# Altium schematic sheet mechanical.SchDoc
size A
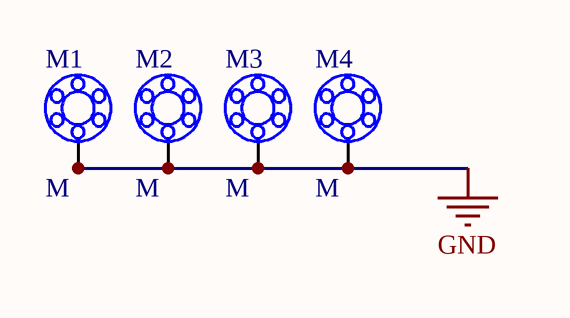
[diagram p0: mechanical.SchDoc]

## Parts
M1  M  [MOUNTING]  (no BOM)
M2  M  [MOUNTING]  (no BOM)
M3  M  [MOUNTING]  (no BOM)
M4  M  [MOUNTING]  (no BOM)

## Nets
GND: M1.1 M1.2 M1.3 M1.4 M1.5 M1.6 M1.7 M2.1 M2.2 M2.3 M2.4 M2.5 M2.6 M2.7 M3.1 M3.2 M3.3 M3.4 M3.5 M3.6 M3.7 M4.1 M4.2 M4.3 M4.4 M4.5 M4.6 M4.7

## Library data of the parts
M1-M4 = MOUNTING: MOUNTING HOLE - NON INSTALLABLE